# Altium schematic sheet 4bitDecoder.SchDoc
size 203 x 88 mm; SheetNumber: 2; SheetTotal: 3
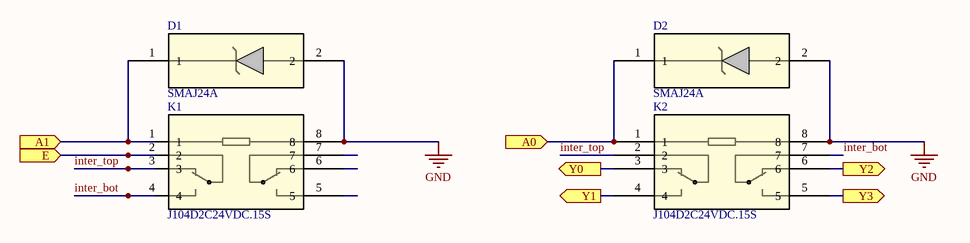
[diagram p0: 4bitDecoder.SchDoc]

## Parts
D1  SMAJ24A  [DI SMAJ24A]
D2  SMAJ24A  [DI SMAJ24A]
K1  J104D2C24VDC.15S  [Relay J104D2C24VDC.15S]
K2  J104D2C24VDC.15S  [Relay J104D2C24VDC.15S]

## Ports
A0 (in, see RAM_MUX4_top[5B]), A1 (in, see RAM_MUX4_top[5B]), E (in, see RAM_MUX4_top[5B]), Y0 (out, see RAM_MUX4_top[5B]), Y1 (out, see RAM_MUX4_top[5B]), Y2 (out, see RAM_MUX4_top[5B]), Y3 (out, see RAM_MUX4_top[5B])

## Nets
GND: D1.2 D2.2 K1.8 K2.8
A0: D2.1 K2.1 ; port A0
A1: D1.1 K1.1 ; port A1
E: K1.2 ; port E
inter_bot: K1.4 K2.7
inter_top: K1.3 K2.2
Y0: K2.3 ; port Y0
Y1: K2.4 ; port Y1
Y2: K2.6 ; port Y2
Y3: K2.5 ; port Y3

Not connected (* = marked no-connect by the designer): K1 5 6 7

## Library data of the parts
D1 D2 = DI SMAJ24A: SMAJ Series 400 W 24 V Uni-Directional Surface Mount TVS Diode - DO-214AC; Manufacturer: Littelfuse; Breakdown Voltage: 28.1V; Value: 650pF; Clamping Voltage: 38.9V; Direction: Unidirectional; Element Configuration: Single; Forward Voltage: 3.5V; Leakage Current: 1µA; Max Breakdown Voltage: 29.5V; Max Junction Temperature (Tj): 150°C; Max Output current: 10.3A; Max Power Dissipation: 3.3W; Min Breakdown Voltage: 26.7V; Number of Channels: 1; Operating Supply Voltage: 24V; Peak Pulse Power: 400W; Power Line Protection: No; Test Current: 1mA; Supplier: DigiKey; Supplier Part Number: SMAJ24ALFCT-ND; Manufacturer Part Number: SMAJ24A; RoHS: Compliant; Category: TVS Diodes; Stock: 97583; Pricing: 1=0.21, 10=0.113, 100=0.074, 500=0.072, 1000=0.071 (USD); Case/Package: SMA; China RoHS: Non-Compliant; Composition: Zener; Height: 2.29mm; Lead Free: Lead Free; Length: 4.5mm; Lifecycle Status: Production; Max Operating Temperature: 150°C; Max Reverse Leakage Current: 1µA; Max Surge Current: 10.3A; Min Operating Temperature: -65°C; Mounting Technology: Surface Mount; Number of Elements: 1; Pins: 2; Number of Terminals: 2; Number of Unidirectional Channels: 1; Packaging: Tape & Reel; Peak Pulse Current: 10.3A; Peak Reverse Current: 1µA; Polarity: Unidirectional; Power Dissipation: 400W; Power Rating: 400W; Radiation Hardening: No; REACH SVHC: No; Reverse Breakdown Voltage: 26.7V; Reverse Standoff Voltage: 24V; Reverse Voltage: 24V; Schedule B: 8541100080, 8541100080|8541100080|8541100080|8541100080|8541100080; Termination: SMD/SMT; Voltage Rating (DC): 24V; Width: 2.79mm; ComponentLink1URL: https://datasheet.octopart.com:443/SMAJ24A-Littelfuse-datasheet-150463581.pdf?src-supplier=Farnell; ComponentLink1Description: https://datasheet.octopart.com:443/SMAJ24A-Littelfuse-datasheet-150463581.pdf?src-supplier=Farnell; ComponentLink2URL: https://datasheet.octopart.com:443/SMAJ24A-Littelfuse-datasheet-63710798.pdf?src-supplier=element14+APAC; ComponentLink2Description: https://datasheet.octopart.com:443/SMAJ24A-Littelfuse-datasheet-63710798.pdf?src-supplier=element14+APAC; ComponentLink3URL: https://datasheet.octopart.com:443/SMAJ24A-Littelfuse-datasheet-11547152.pdf?src-supplier=element14+APAC; ComponentLink3Description: https://datasheet.octopart.com:443/SMAJ24A-Littelfuse-datasheet-11547152.pdf?src-supplier=element14+APAC; ComponentLink4URL: https://datasheet.octopart.com:443/SMAJ24A-Littelfuse-datasheet-5393952.pdf?src-supplier=element14+APAC; ComponentLink4Description: https://datasheet.octopart.com:443/SMAJ24A-Littelfuse-datasheet-5393952.pdf?src-supplier=element14+APAC; ComponentLink5URL: https://datasheet.octopart.com:443/SMAJ24A-Littelfuse-datasheet-511791.pdf?src-supplier=element14+APAC; ComponentLink5Description: https://datasheet.octopart.com:443/SMAJ24A-Littelfuse-datasheet-511791.pdf?src-supplier=element14+APAC; ComponentLink6URL: https://datasheet.octopart.com:443/SMAJ24A-Littelfuse-datasheet-164649624.pdf?src-supplier=JRH+Electronics; ComponentLink6Description: https://datasheet.octopart.com:443/SMAJ24A-Littelfuse-datasheet-164649624.pdf?src-supplier=JRH+Electronics; ComponentLink7URL: https://datasheet.octopart.com:443/SMAJ24A-Littelfuse-datasheet-38878911.pdf?src-supplier=RS+(Formerly+Allied+Electronics); ComponentLink7Description: https://datasheet.octopart.com:443/SMAJ24A-Littelfuse-datasheet-38878911.pdf?src-supplier=RS+(Formerly+Allied+Electronics); ComponentLink8URL: https://datasheet.octopart.com:443/SMAJ24A-Littelfuse-datasheet-17901671.pdf?src-supplier=Future+Electronics; ComponentLink8Description: https://datasheet.octopart.com:443/SMAJ24A-Littelfuse-datasheet-17901671.pdf?src-supplier=Future+Electronics; ComponentLink9URL: https://datasheet.octopart.com:443/SMAJ24A-Littelfuse-datasheet-1053.pdf?src-supplier=DigiKey; ComponentLink9Description: https://datasheet.octopart.com:443/SMAJ24A-Littelfuse-datasheet-1053.pdf?src-supplier=DigiKey
K1 K2 = Relay J104D2C24VDC.15S: Relay Ul Gen Purp DPDT 2C 24VDC; Manufacturer: CIT Relay & Switch; Coil Current: 6mA; Coil Power: 150mW; Coil Resistance: 3.84kΩ; Coil Voltage (DC): 18V; Contact Current Rating: 2A; Contact Resistance: 50mΩ; Contact Voltage Rating (AC): 250V; Electrical Life: 100kcycles; Insulation Resistance: 100MΩ; Max Voltage Rating (DC): 100V; Release Time: 4ms; Response Time: 6ms; Supplier: DigiKey; Supplier Part Number: 2449-J104D2C24VDC.15S-ND; Manufacturer Part Number: J104D2C24VDC.15S; Category: Signal Relays; Stock: 5620; Pricing: 1=1.26, 20=1.082, 40=1.045, 60=1.02383, 100=0.998, 260=0.95115, 500=0.92036, 1000=0.88878, 5000=0.8195 (USD); Contact Plating: Gold; Height: 11.42mm; Length: 20.37mm; Max Current Rating: 2A; Max Operating Temperature: 85°C; Min Operating Temperature: -40°C; Number of Terminals: 8; Throw Configuration: DPDT